# EAGLE schematic EE02Breakout (EAGLE 7.6.0)
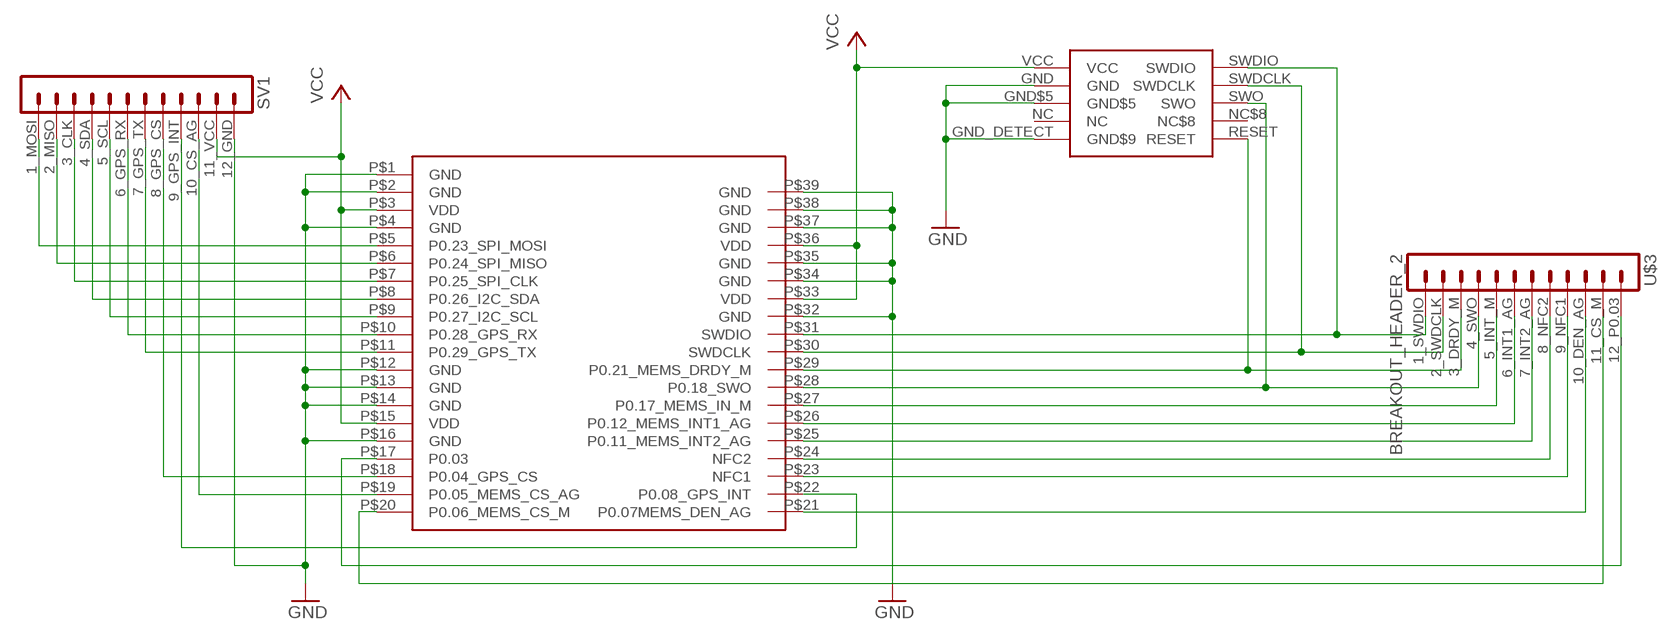
[diagram p0: schematic, sheet 1]

## Parts
SV1  BREAKOUT_HEADER_1BREAKOUT_HEADER_2  [BRH1]
U$1  EE02  [EE02]
U$2  DEBUGHEADER  [NRF52-P19-CONNECTOR]
U$3  BREAKOUT_HEADER_2  [BRH2]

## Nets
GND: U$1.P$32(GND) U$1.P$34(GND) U$1.P$35(GND) U$1.P$37(GND) U$1.P$38(GND) U$1.P$39(GND) U$2.GND U$2.GND$5 U$2.GND_DETECT(GND$9)
N$1: SV1.12_GND U$1.P$1(GND) U$1.P$2(GND) U$1.P$4(GND) U$1.P$12(GND) U$1.P$13(GND) U$1.P$14(GND) U$1.P$16(GND)
N$2: U$1.P$21(P0.07MEMS_DEN_AG) U$3.10_DEN_AG
N$3: U$1.P$20(P0.06_MEMS_CS_M) U$3.11_CS_M
N$4: SV1.10_CS_AG U$1.P$19(P0.05_MEMS_CS_AG)
N$5: SV1.9_GPS_INT U$1.P$22(P0.08_GPS_INT)
N$6: SV1.8_GPS_CS U$1.P$18(P0.04_GPS_CS)
N$7: SV1.7_GPS_TX U$1.P$11(P0.29_GPS_TX)
N$8: SV1.6_GPS_RX U$1.P$10(P0.28_GPS_RX)
N$9: SV1.5_SCL U$1.P$9(P0.27_I2C_SCL)
N$10: SV1.4_SDA U$1.P$8(P0.26_I2C_SDA)
N$11: SV1.3_CLK U$1.P$7(P0.25_SPI_CLK)
N$12: SV1.2_MISO U$1.P$6(P0.24_SPI_MISO)
N$13: SV1.1_MOSI U$1.P$5(P0.23_SPI_MOSI)
N$14: U$1.P$31(SWDIO) U$2.SWDIO U$3.1_SWDIO
N$15: U$1.P$30(SWDCLK) U$2.SWDCLK U$3.2_SWDCLK
N$16: U$1.P$29(P0.21_MEMS_DRDY_M) U$2.RESET U$3.3_DRDY_M
N$17: U$1.P$28(P0.18_SWO) U$2.SWO U$3.4_SWO
N$18: U$1.P$27(P0.17_MEMS_IN_M) U$3.5_INT_M
N$19: U$1.P$26(P0.12_MEMS_INT1_AG) U$3.6_INT1_AG
N$20: U$1.P$25(P0.11_MEMS_INT2_AG) U$3.7_INT2_AG
N$21: U$1.P$24(NFC2) U$3.8_NFC2
N$22: U$1.P$23(NFC1) U$3.9_NFC1
N$23: U$1.P$17(P0.03) U$3.12_P0.03
VCC: SV1.11_VCC(11_3V) U$1.P$3(VDD) U$1.P$15(VDD) U$1.P$33(VDD) U$1.P$36(VDD) U$2.VCC
Unconnected: U$2.NC U$2.NC$8

## Library data of the parts
SV1 = EE:BREAKOUT_HEADER_1: PIN HEADER; OC_FARNELL: unknown; OC_NEWARK: unknown
U$1 = EE:EE02: EE02 Lora Module
U$2 = EE:DEBUGHEADER: DEBUG HEADER
U$3 = EE:BREAKOUT_HEADER_2